# Altium project Conv-Comp.PrjPCB
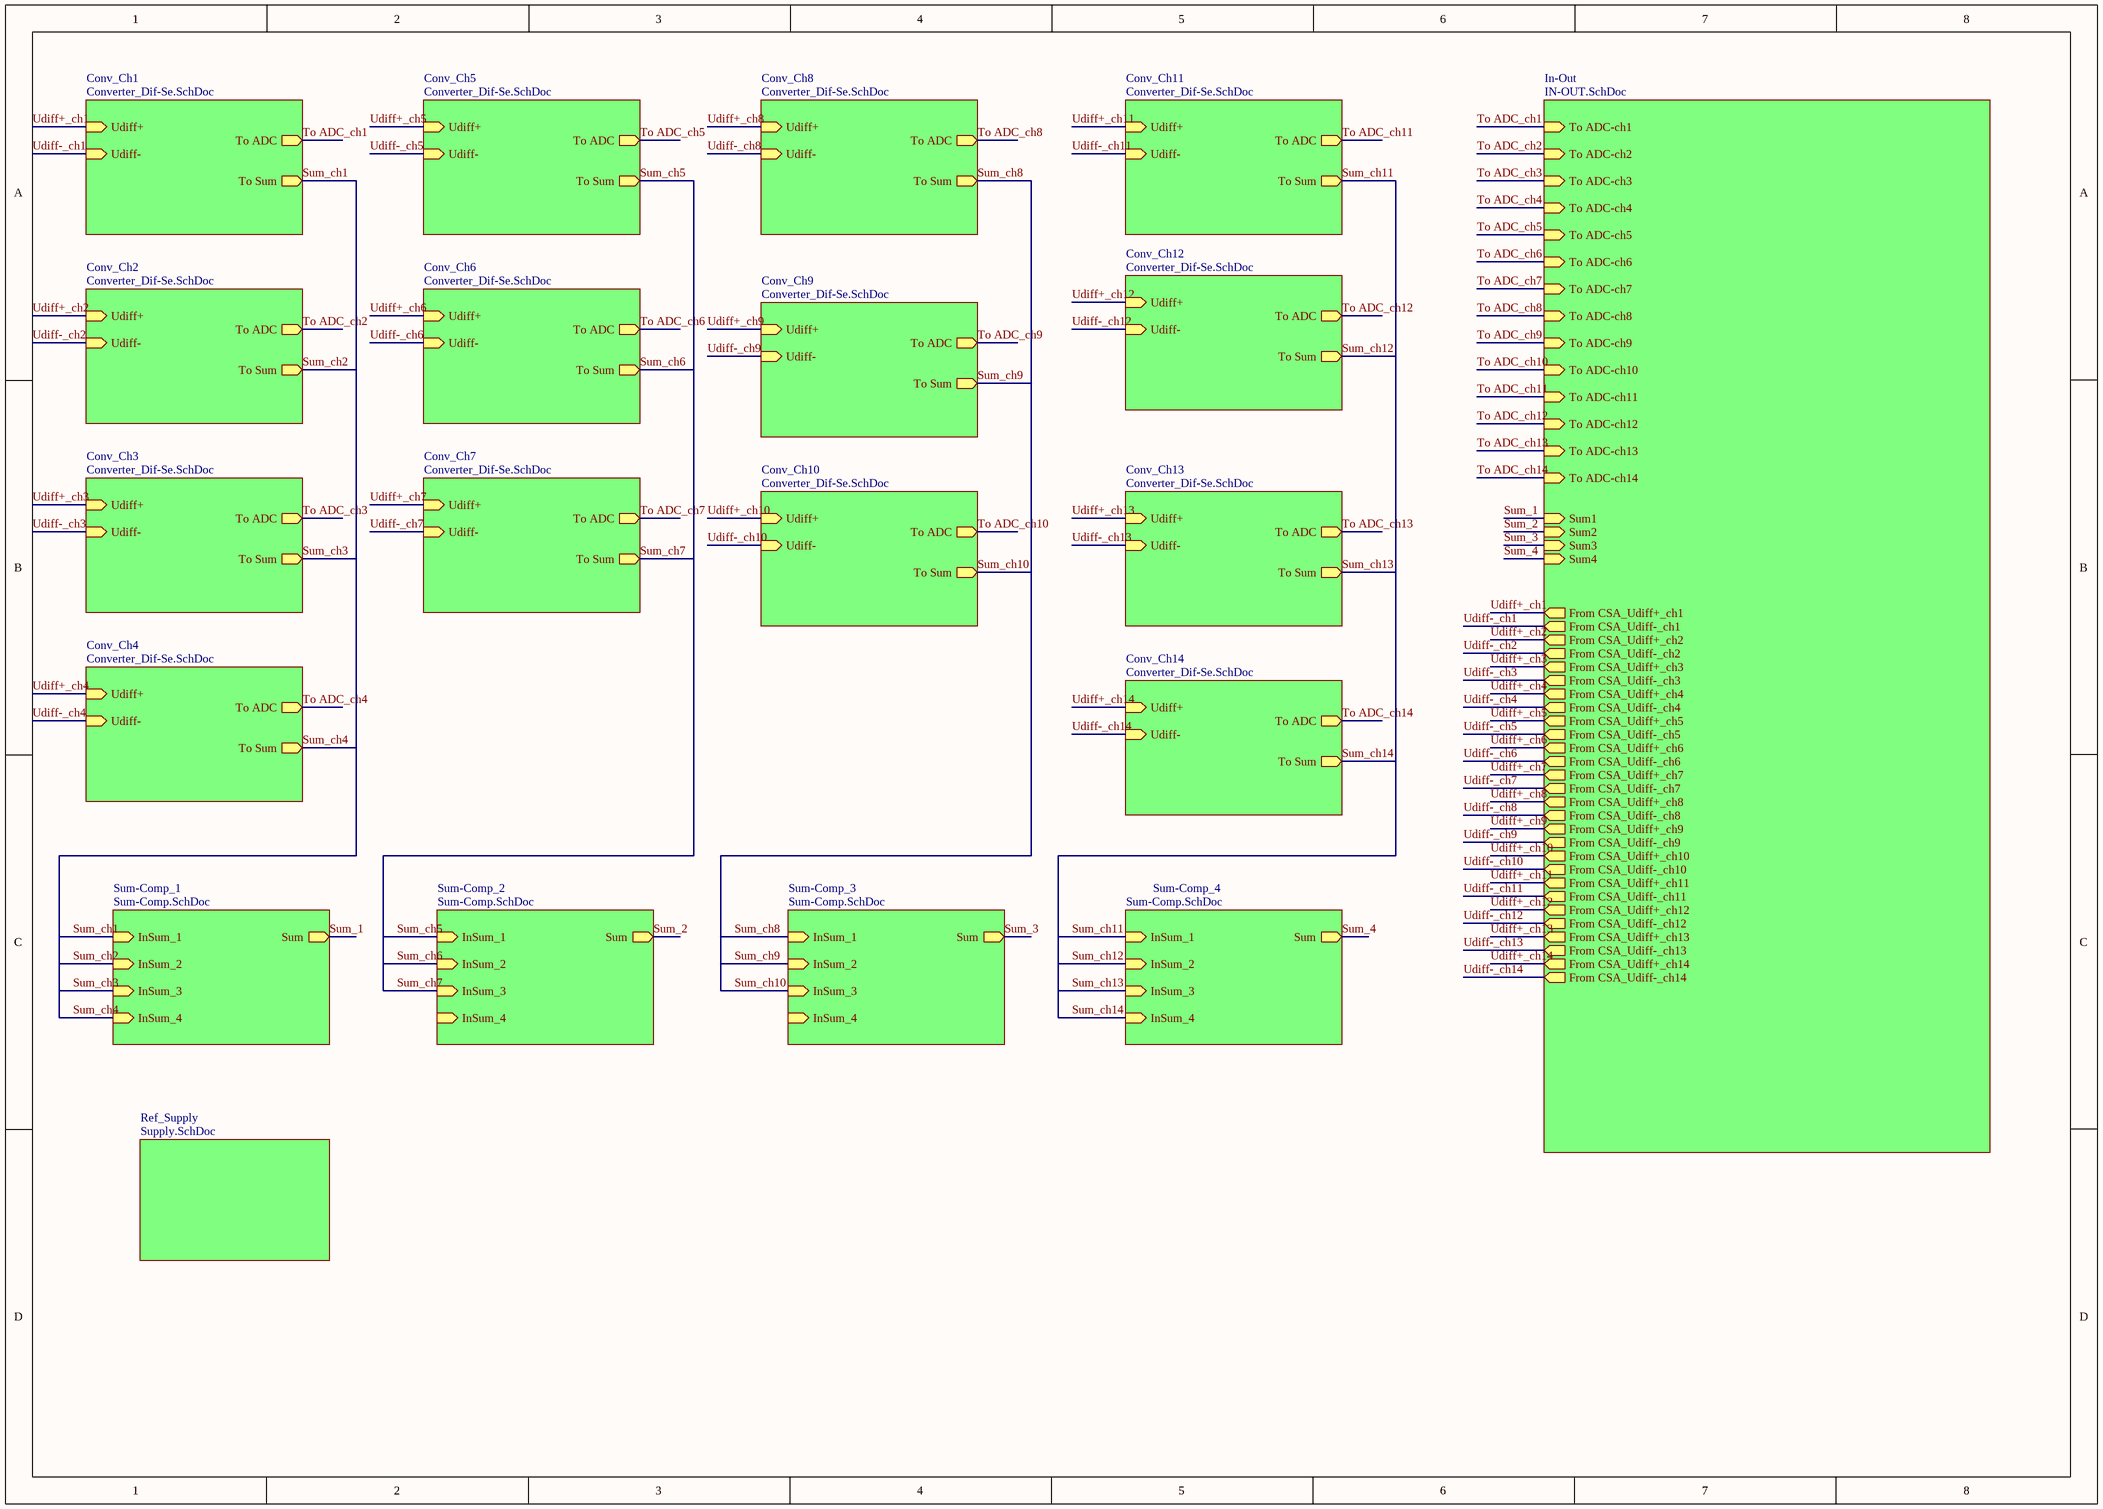
[diagram p0: Main.schdoc]
5 sheets, 255 parts. Net scope: hierarchical (ports join the sheet entries above them; power ports are global).
Board file: Conv-Comp_v.2.PCBDOC
Sheets:
  Main.schdoc
    Conv_Ch1 = Converter_Dif-Se.SchDoc
    Sum-Comp_1 = Sum-Comp.SchDoc
    Sum-Comp_2 = Sum-Comp.SchDoc
    Sum-Comp_3 = Sum-Comp.SchDoc
    Sum-Comp_4 = Sum-Comp.SchDoc
    Ref_Supply = Supply.SchDoc
    Conv_Ch2 = Converter_Dif-Se.SchDoc
    Conv_Ch3 = Converter_Dif-Se.SchDoc
    Conv_Ch4 = Converter_Dif-Se.SchDoc
    Conv_Ch5 = Converter_Dif-Se.SchDoc
    Conv_Ch6 = Converter_Dif-Se.SchDoc
    Conv_Ch7 = Converter_Dif-Se.SchDoc
    Conv_Ch8 = Converter_Dif-Se.SchDoc
    Conv_Ch9 = Converter_Dif-Se.SchDoc
    Conv_Ch10 = Converter_Dif-Se.SchDoc
    Conv_Ch11 = Converter_Dif-Se.SchDoc
    Conv_Ch12 = Converter_Dif-Se.SchDoc
    Conv_Ch13 = Converter_Dif-Se.SchDoc
    Conv_Ch14 = Converter_Dif-Se.SchDoc
    In-Out = IN-OUT.SchDoc

## Sheet Main.schdoc: Eurocard VME 6U with break-away tab (9.187 x 6.299 inches)
size A3; Organization: Organization; Address1: Address1; Address2: Address2; Address3: Address3; Address4: Address4; DocumentNumber: 1; Revision: 0; SheetNumber: 2; SheetTotal: 2

### Sub-sheets
Conv_Ch1 = Converter_Dif-Se.SchDoc: To ADC (out), To Sum (out), Udiff+ (in), Udiff- (in)
Conv_Ch2 = Converter_Dif-Se.SchDoc: To ADC (out), To Sum (out), Udiff+ (in), Udiff- (in)
Conv_Ch3 = Converter_Dif-Se.SchDoc: To ADC (out), To Sum (out), Udiff+ (in), Udiff- (in)
Conv_Ch4 = Converter_Dif-Se.SchDoc: To ADC (out), To Sum (out), Udiff+ (in), Udiff- (in)
Conv_Ch5 = Converter_Dif-Se.SchDoc: To ADC (out), To Sum (out), Udiff+ (in), Udiff- (in)
Conv_Ch6 = Converter_Dif-Se.SchDoc: To ADC (out), To Sum (out), Udiff+ (in), Udiff- (in)
Conv_Ch7 = Converter_Dif-Se.SchDoc: To ADC (out), To Sum (out), Udiff+ (in), Udiff- (in)
Conv_Ch8 = Converter_Dif-Se.SchDoc: To ADC (out), To Sum (out), Udiff+ (in), Udiff- (in)
Conv_Ch9 = Converter_Dif-Se.SchDoc: To ADC (out), To Sum (out), Udiff+ (in), Udiff- (in)
Conv_Ch10 = Converter_Dif-Se.SchDoc: To ADC (out), To Sum (out), Udiff+ (in), Udiff- (in)
Conv_Ch11 = Converter_Dif-Se.SchDoc: To ADC (out), To Sum (out), Udiff+ (in), Udiff- (in)
Conv_Ch12 = Converter_Dif-Se.SchDoc: To ADC (out), To Sum (out), Udiff+ (in), Udiff- (in)
Conv_Ch13 = Converter_Dif-Se.SchDoc: To ADC (out), To Sum (out), Udiff+ (in), Udiff- (in)
Conv_Ch14 = Converter_Dif-Se.SchDoc: To ADC (out), To Sum (out), Udiff+ (in), Udiff- (in)
In-Out = IN-OUT.SchDoc: To ADC-ch1 (in), To ADC-ch2 (in), To ADC-ch3 (in), To ADC-ch4 (in), To ADC-ch5 (in), To ADC-ch6 (in), To ADC-ch7 (in), To ADC-ch8 (in), To ADC-ch9 (in), To ADC-ch10 (in), To ADC-ch11 (in), To ADC-ch12 (in), To ADC-ch13 (in), To ADC-ch14 (in), From CSA_Udiff+_ch1 (out), From CSA_Udiff+_ch2 (out), From CSA_Udiff+_ch3 (out), From CSA_Udiff+_ch4 (out), From CSA_Udiff+_ch5 (out), From CSA_Udiff+_ch6 (out), From CSA_Udiff+_ch7 (out), From CSA_Udiff+_ch8 (out), From CSA_Udiff+_ch9 (out), From CSA_Udiff+_ch10 (out), From CSA_Udiff+_ch11 (out), From CSA_Udiff+_ch12 (out), From CSA_Udiff+_ch13 (out), From CSA_Udiff+_ch14 (out), From CSA_Udiff-_ch1 (out), From CSA_Udiff-_ch2 (out), From CSA_Udiff-_ch3 (out), From CSA_Udiff-_ch4 (out), From CSA_Udiff-_ch5 (out), From CSA_Udiff-_ch6 (out), From CSA_Udiff-_ch7 (out), From CSA_Udiff-_ch8 (out), From CSA_Udiff-_ch9 (out), From CSA_Udiff-_ch10 (out), From CSA_Udiff-_ch11 (out), From CSA_Udiff-_ch12 (out), From CSA_Udiff-_ch13 (out), From CSA_Udiff-_ch14 (out), Sum4 (in), Sum3 (in), Sum2 (in), Sum1 (in)
Ref_Supply = Supply.SchDoc: no entries
Sum-Comp_1 = Sum-Comp.SchDoc: InSum_1 (in), InSum_2 (in), InSum_3 (in), InSum_4 (in), Sum (out)
Sum-Comp_2 = Sum-Comp.SchDoc: InSum_1 (in), InSum_2 (in), InSum_3 (in), InSum_4 (in), Sum (out)
Sum-Comp_3 = Sum-Comp.SchDoc: InSum_1 (in), InSum_2 (in), InSum_3 (in), InSum_4 (in), Sum (out)
Sum-Comp_4 = Sum-Comp.SchDoc: InSum_1 (in), InSum_2 (in), InSum_3 (in), InSum_4 (in), Sum (out)

### Nets
Sum_1: sheet Sum-Comp_1/Sum, sheet In-Out/Sum1
Sum_2: sheet Sum-Comp_2/Sum, sheet In-Out/Sum2
Sum_3: sheet Sum-Comp_3/Sum, sheet In-Out/Sum3
Sum_4: sheet Sum-Comp_4/Sum, sheet In-Out/Sum4
Sum_ch1: sheet Conv_Ch1/To Sum, sheet Sum-Comp_1/InSum_1, sheet Sum-Comp_1/InSum_2, sheet Sum-Comp_1/InSum_3, sheet Sum-Comp_1/InSum_4, sheet Conv_Ch2/To Sum, sheet Conv_Ch3/To Sum, sheet Conv_Ch4/To Sum  [also labelled Sum_ch2, Sum_ch3, Sum_ch4]
Sum_ch5: sheet Sum-Comp_2/InSum_1, sheet Sum-Comp_2/InSum_2, sheet Sum-Comp_2/InSum_3, sheet Sum-Comp_2/InSum_4, sheet Conv_Ch5/To Sum, sheet Conv_Ch6/To Sum, sheet Conv_Ch7/To Sum  [also labelled Sum_ch6, Sum_ch7]
Sum_ch10: sheet Sum-Comp_3/InSum_1, sheet Sum-Comp_3/InSum_2, sheet Sum-Comp_3/InSum_3, sheet Sum-Comp_3/InSum_4, sheet Conv_Ch8/To Sum, sheet Conv_Ch9/To Sum, sheet Conv_Ch10/To Sum  [also labelled Sum_ch8, Sum_ch9]
Sum_ch11: sheet Sum-Comp_4/InSum_1, sheet Sum-Comp_4/InSum_2, sheet Sum-Comp_4/InSum_3, sheet Sum-Comp_4/InSum_4, sheet Conv_Ch11/To Sum, sheet Conv_Ch12/To Sum, sheet Conv_Ch13/To Sum, sheet Conv_Ch14/To Sum  [also labelled Sum_ch12, Sum_ch13, Sum_ch14]
To ADC_ch1: sheet Conv_Ch1/To ADC, sheet In-Out/To ADC-ch1
To ADC_ch2: sheet Conv_Ch2/To ADC, sheet In-Out/To ADC-ch2
To ADC_ch3: sheet Conv_Ch3/To ADC, sheet In-Out/To ADC-ch3
To ADC_ch4: sheet Conv_Ch4/To ADC, sheet In-Out/To ADC-ch4
To ADC_ch5: sheet Conv_Ch5/To ADC, sheet In-Out/To ADC-ch5
To ADC_ch6: sheet Conv_Ch6/To ADC, sheet In-Out/To ADC-ch6
To ADC_ch7: sheet Conv_Ch7/To ADC, sheet In-Out/To ADC-ch7
To ADC_ch8: sheet Conv_Ch8/To ADC, sheet In-Out/To ADC-ch8
To ADC_ch9: sheet Conv_Ch9/To ADC, sheet In-Out/To ADC-ch9
To ADC_ch10: sheet Conv_Ch10/To ADC, sheet In-Out/To ADC-ch10
To ADC_ch11: sheet Conv_Ch11/To ADC, sheet In-Out/To ADC-ch11
To ADC_ch12: sheet Conv_Ch12/To ADC, sheet In-Out/To ADC-ch12
To ADC_ch13: sheet Conv_Ch13/To ADC, sheet In-Out/To ADC-ch13
To ADC_ch14: sheet Conv_Ch14/To ADC, sheet In-Out/To ADC-ch14
Udiff+_ch1: sheet Conv_Ch1/Udiff+, sheet In-Out/From CSA_Udiff+_ch1
Udiff+_ch2: sheet Conv_Ch2/Udiff+, sheet In-Out/From CSA_Udiff+_ch2
Udiff+_ch3: sheet Conv_Ch3/Udiff+, sheet In-Out/From CSA_Udiff+_ch3
Udiff+_ch4: sheet Conv_Ch4/Udiff+, sheet In-Out/From CSA_Udiff+_ch4
Udiff+_ch5: sheet Conv_Ch5/Udiff+, sheet In-Out/From CSA_Udiff+_ch5
Udiff+_ch6: sheet Conv_Ch6/Udiff+, sheet In-Out/From CSA_Udiff+_ch6
Udiff+_ch7: sheet Conv_Ch7/Udiff+, sheet In-Out/From CSA_Udiff+_ch7
Udiff+_ch8: sheet Conv_Ch8/Udiff+, sheet In-Out/From CSA_Udiff+_ch8
Udiff+_ch9: sheet Conv_Ch9/Udiff+, sheet In-Out/From CSA_Udiff+_ch9
Udiff+_ch10: sheet Conv_Ch10/Udiff+, sheet In-Out/From CSA_Udiff+_ch10
Udiff+_ch11: sheet Conv_Ch11/Udiff+, sheet In-Out/From CSA_Udiff+_ch11
Udiff+_ch12: sheet Conv_Ch12/Udiff+, sheet In-Out/From CSA_Udiff+_ch12
Udiff+_ch13: sheet Conv_Ch13/Udiff+, sheet In-Out/From CSA_Udiff+_ch13
Udiff+_ch14: sheet Conv_Ch14/Udiff+, sheet In-Out/From CSA_Udiff+_ch14
Udiff-_ch1: sheet Conv_Ch1/Udiff-, sheet In-Out/From CSA_Udiff-_ch1
Udiff-_ch2: sheet Conv_Ch2/Udiff-, sheet In-Out/From CSA_Udiff-_ch2
Udiff-_ch3: sheet Conv_Ch3/Udiff-, sheet In-Out/From CSA_Udiff-_ch3
Udiff-_ch4: sheet Conv_Ch4/Udiff-, sheet In-Out/From CSA_Udiff-_ch4
Udiff-_ch5: sheet Conv_Ch5/Udiff-, sheet In-Out/From CSA_Udiff-_ch5
Udiff-_ch6: sheet Conv_Ch6/Udiff-, sheet In-Out/From CSA_Udiff-_ch6
Udiff-_ch7: sheet Conv_Ch7/Udiff-, sheet In-Out/From CSA_Udiff-_ch7
Udiff-_ch8: sheet Conv_Ch8/Udiff-, sheet In-Out/From CSA_Udiff-_ch8
Udiff-_ch9: sheet Conv_Ch9/Udiff-, sheet In-Out/From CSA_Udiff-_ch9
Udiff-_ch10: sheet Conv_Ch10/Udiff-, sheet In-Out/From CSA_Udiff-_ch10
Udiff-_ch11: sheet Conv_Ch11/Udiff-, sheet In-Out/From CSA_Udiff-_ch11
Udiff-_ch12: sheet Conv_Ch12/Udiff-, sheet In-Out/From CSA_Udiff-_ch12
Udiff-_ch13: sheet Conv_Ch13/Udiff-, sheet In-Out/From CSA_Udiff-_ch13
Udiff-_ch14: sheet Conv_Ch14/Udiff-, sheet In-Out/From CSA_Udiff-_ch14

## Sheet Converter_Dif-Se.SchDoc
size A
Used 14 times, as channels Conv_Ch1, Conv_Ch2, Conv_Ch3, Conv_Ch4, Conv_Ch5, Conv_Ch6, Conv_Ch7, Conv_Ch8, Conv_Ch9, Conv_Ch10, Conv_Ch11, Conv_Ch12, Conv_Ch13, Conv_Ch14. Parts and nets are listed once, with the designators drawn on the sheet.
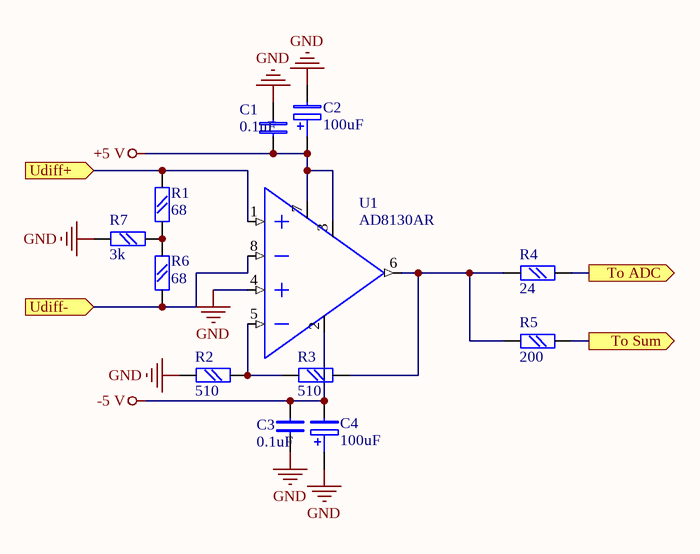
[diagram p1: Converter_Dif-Se.SchDoc]

### Parts
C1  0.1uF  [chip0805]
C2  100uF  [CEL-SMD300]
C3  0.1uF  [chip0805]
C4  100uF  [CEL-SMD300]
R1  68  [chip0805]
R2  510  [chip0805]
R3  510  [chip0805]
R4  24  [chip0805]
R5  200  [chip0805]
R6  68  [chip0805]
R7  3k  [chip0805]
U1  AD8130AR  [SO-8]

### Ports
To ADC (out), To Sum (out), Udiff+ (in), Udiff- (in)

### Nets
+5 V: C1.2 C2.+ U1.3(PD) U1.7(E+)
-5 V: C3.1 C4.- U1.2(E-)
GND: C1.1 C2.- C3.2 C4.+ R2.1 R7.2 U1.4(IN+)
To ADC: R4.2 ; port To ADC
To Sum: R5.2 ; port To Sum
Udiff+: R1.1 U1.1(+IN) ; port Udiff+
Udiff-: R6.2 U1.8(-IN) ; port Udiff-
NetR1_2: R1.2 R6.1 R7.1
NetR2_2: R2.2 R3.1 U1.5(IN-)
NetR3_2: R3.2 R4.1 R5.1 U1.6(OUT)

### Channels
Conv_Ch1: designators end in _Conv_Ch1; ports To ADC=To ADC_ch1 To Sum=Sum_ch1 Udiff+=Udiff+_ch1 Udiff-=Udiff-_ch1
Conv_Ch2: designators end in _Conv_Ch2; ports To ADC=To ADC_ch2 To Sum=Sum_ch1 Udiff+=Udiff+_ch2 Udiff-=Udiff-_ch2
Conv_Ch3: designators end in _Conv_Ch3; ports To ADC=To ADC_ch3 To Sum=Sum_ch1 Udiff+=Udiff+_ch3 Udiff-=Udiff-_ch3
Conv_Ch4: designators end in _Conv_Ch4; ports To ADC=To ADC_ch4 To Sum=Sum_ch1 Udiff+=Udiff+_ch4 Udiff-=Udiff-_ch4
Conv_Ch5: designators end in _Conv_Ch5; ports To ADC=To ADC_ch5 To Sum=Sum_ch5 Udiff+=Udiff+_ch5 Udiff-=Udiff-_ch5
Conv_Ch6: designators end in _Conv_Ch6; ports To ADC=To ADC_ch6 To Sum=Sum_ch5 Udiff+=Udiff+_ch6 Udiff-=Udiff-_ch6
Conv_Ch7: designators end in _Conv_Ch7; ports To ADC=To ADC_ch7 To Sum=Sum_ch5 Udiff+=Udiff+_ch7 Udiff-=Udiff-_ch7
Conv_Ch8: designators end in _Conv_Ch8; ports To ADC=To ADC_ch8 To Sum=Sum_ch10 Udiff+=Udiff+_ch8 Udiff-=Udiff-_ch8
Conv_Ch9: designators end in _Conv_Ch9; ports To ADC=To ADC_ch9 To Sum=Sum_ch10 Udiff+=Udiff+_ch9 Udiff-=Udiff-_ch9
Conv_Ch10: designators end in _Conv_Ch10; ports To ADC=To ADC_ch10 To Sum=Sum_ch10 Udiff+=Udiff+_ch10 Udiff-=Udiff-_ch10
Conv_Ch11: designators end in _Conv_Ch11; ports To ADC=To ADC_ch11 To Sum=Sum_ch11 Udiff+=Udiff+_ch11 Udiff-=Udiff-_ch11
Conv_Ch12: designators end in _Conv_Ch12; ports To ADC=To ADC_ch12 To Sum=Sum_ch11 Udiff+=Udiff+_ch12 Udiff-=Udiff-_ch12
Conv_Ch13: designators end in _Conv_Ch13; ports To ADC=To ADC_ch13 To Sum=Sum_ch11 Udiff+=Udiff+_ch13 Udiff-=Udiff-_ch13
Conv_Ch14: designators end in _Conv_Ch14; ports To ADC=To ADC_ch14 To Sum=Sum_ch11 Udiff+=Udiff+_ch14 Udiff-=Udiff-_ch14

### Library data of the parts
C1 C3 = C: Text Field1: 20; Text Field2: 10
C2 C4 = C POL: Text Field1: 20; Text Field2: 20
R1-R7 = R: Text Field1: 20; Text Field2: 20
U1 = AD8130

## Sheet Sum-Comp.SchDoc
size A
Used 4 times, as channels Sum-Comp_1, Sum-Comp_2, Sum-Comp_3, Sum-Comp_4. Parts and nets are listed once, with the designators drawn on the sheet.
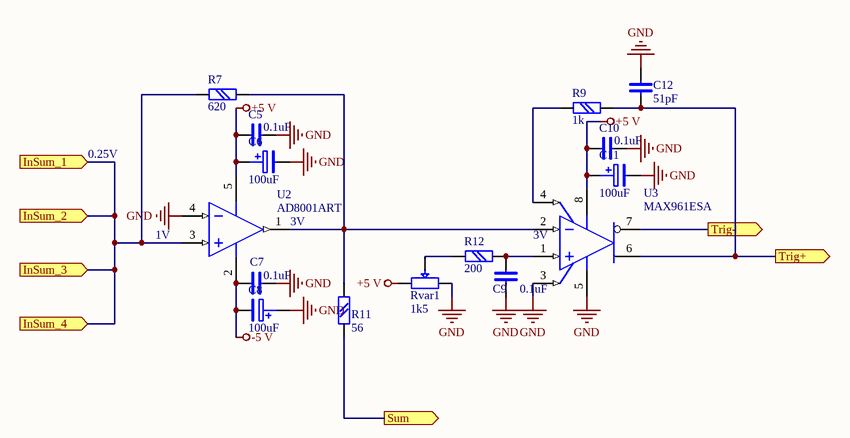
[diagram p2: Sum-Comp.SchDoc]

### Parts
C5  0.1uF  [chip0805]
C6  100uF  [CEL-SMD300]
C7  0.1uF  [chip0805]
C8  100uF  [CEL-SMD300]
C9  0.1uF  [chip0805]
C10  0.1uF  [chip0805]
C11  100uF  [CEL-SMD300]
C12  51pF  [chip0805]
R7  620  [chip0805]
R9  1k  [chip0805]
R11  56  [chip0805]
R12  200  [chip0805]
Rvar1  1k5  [RVAR1]
U2  AD8001ART  [RT-5]
U3  MAX961ESA  [NSO8_N]

### Ports
InSum_1 (in), InSum_2 (in), InSum_3 (in), InSum_4 (in), Sum (out), Trig+ (out), Trig- (out)

### Nets
+5 V: C5.2 C6.+ C10.2 C11.+ Rvar1.1 U2.5(V+) U3.8(V+)
-5 V: C7.2 C8.- U2.2(V-)
GND: C5.1 C6.- C7.1 C8.+ C9.1 C10.1 C11.- C12.1 Rvar1.3 U2.4(IN-) U3.3(SHDN) U3.5(GND)
InSum_1: R7.1 U2.3(IN+) ; port InSum_1, port InSum_2, port InSum_3, port InSum_4
Sum: R11.1 ; port Sum
Trig+: C12.2 R9.2 U3.6(Q) ; port Trig+
Trig-: U3.7(~{Q}) ; port Trig-
NetC9_2: C9.2 R12.2 U3.1(IN+)
NetR7_2: R7.2 R11.2 U2.1(OUT) U3.2(IN-)
NetR9_1: R9.1 U3.4(LE)
NetR12_1: R12.1 Rvar1.2

### Channels
Sum-Comp_1: designators end in _Sum-Comp_1; ports InSum_1=Sum_ch1 InSum_2=Sum_ch1 InSum_3=Sum_ch1 InSum_4=Sum_ch1 Sum=Sum_1 Trig+=NetC12_Sum-Comp_1_2 Trig-=NetU3_Sum-Comp_1_7
Sum-Comp_2: designators end in _Sum-Comp_2; ports InSum_1=Sum_ch5 InSum_2=Sum_ch5 InSum_3=Sum_ch5 InSum_4=Sum_ch5 Sum=Sum_2 Trig+=NetC12_Sum-Comp_2_2 Trig-=NetU3_Sum-Comp_2_7
Sum-Comp_3: designators end in _Sum-Comp_3; ports InSum_1=Sum_ch10 InSum_2=Sum_ch10 InSum_3=Sum_ch10 InSum_4=Sum_ch10 Sum=Sum_3 Trig+=NetC12_Sum-Comp_3_2 Trig-=NetU3_Sum-Comp_3_7
Sum-Comp_4: designators end in _Sum-Comp_4; ports InSum_1=Sum_ch11 InSum_2=Sum_ch11 InSum_3=Sum_ch11 InSum_4=Sum_ch11 Sum=Sum_4 Trig+=NetC12_Sum-Comp_4_2 Trig-=NetU3_Sum-Comp_4_7

### Notes on the sheet
- 0.25V
- (near U2) 1V
- (near U2) 3V
- (near U3) 3V

### Library data of the parts
C5 C7 C9 C10 C12 = C: Text Field1: 20; Text Field2: 10
C6 C8 C11 = C POL: Text Field1: 20; Text Field2: 20
R7 R9 R11 R12 = R: Text Field1: 20; Text Field2: 20
Rvar1 = R VAR: Text Field1: 20; Text Field2: 20
U2 = AD8055ART: Low Cost, 300MHz Voltage Feedback Amplifier; Published: 8-Jun-2000; LatestRevisionDate: 17-Jul-2002; LatestRevisionNote: Re-released for DXP Platform.; DatasheetVersion: REV. 0 1997; PackageReference: RT-5; Publisher: Altium Limited; PackageDescription: SOT-23/SC-74A; 5 Leads; Body 3.1 x 3 mm, inc. leads (LxW max); Code_JEDEC: MO-178AA; ComponentLink1Description: Manufacturer Link; ComponentLink1URL: http://www.analog.com/en/prod/0,,759_786_AD8055%2C00.html; ComponentLink2Description: Datasheet; ComponentLink2URL: http://www.analog.com/UploadedFiles/Data_Sheets/40402558757264AD8055_6_i.pdf
U3 = MAX961ESA: Single Ultra-High-Speed, +3V/+5V, Beyond-the-Rails Comparator; Published: 16-Jan-2001; LatestRevisionDate: 13-Apr-2006; LatestRevisionNote: IPC-7351 Footprint Added.; DatasheetVersion: Jan-1998; PackageReference: NSO8; Publisher: Altium Limited; PackageDescription: 8-Pin Small Outline Integrated Circuit 1.27 mm Pitch; Code_JEDEC: MS-012-AA; Code_IPC: SOIC127P600-8; ComponentLink1Description: Manufacturer Link; ComponentLink1URL: http://www.maxim-ic.com/; ComponentLink2Description: Datasheet; ComponentLink2URL: http://pdfserv.maxim-ic.com/en/ds/MAX961-MAX999.pdf

## Sheet Supply.SchDoc
size A4
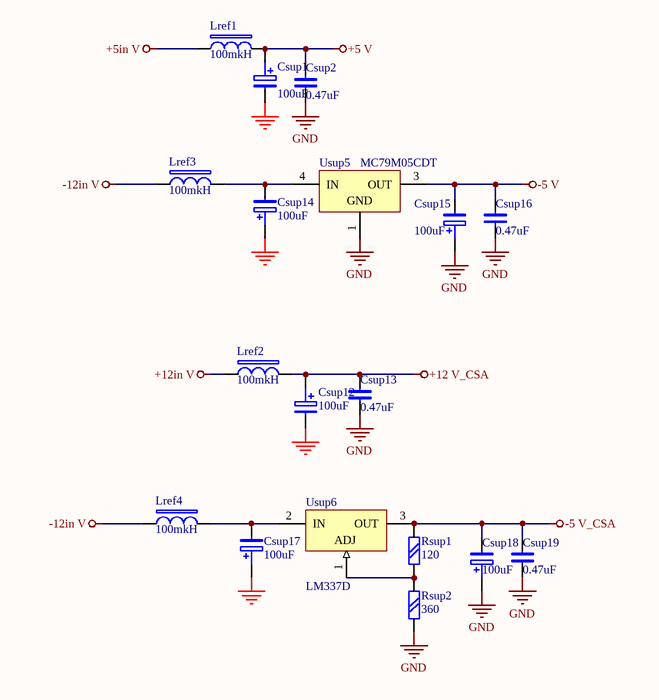
[diagram p3: Supply.SchDoc]

### Parts
Csup1  100uF  [CEL-SMD300]
Csup2  0.47uF  [chip0805]
Csup12  100uF  [CEL-SMD300]
Csup13  0.47uF  [chip0805]
Csup14  100uF  [CEL-SMD300]
Csup15  100uF  [CEL-SMD300]
Csup16  0.47uF  [chip0805]
Csup17  100uF  [CEL-SMD300]
Csup18  100uF  [CEL-SMD300]
Csup19  0.47uF  [chip0805]
Lref1  100mkH  [SDR0604]
Lref2  100mkH  [SDR0604]
Lref3  100mkH  [SDR0604]
Lref4  100mkH  [SDR0604]
Rsup1  120  [chip0805]
Rsup2  360  [chip0805]
Usup5  MC79M05CDT  [369A-13]
Usup6  LM337D  [TO-220B]

### Nets
+5 V: Csup1.+ Csup2.1 Lref1.2
+5in V: Lref1.1
+12 V_CSA: Csup12.+ Csup13.1 Lref2.2
+12in V: Lref2.1
-5 V: Csup15.- Csup16.1 Usup5.3(OUT)
-5 V_CSA: Csup18.- Csup19.1 Rsup1.1 Usup6.3(OUT)
-12in V: Lref3.1 Lref4.1
GND: Csup1.- Csup2.2 Csup12.- Csup13.2 Csup14.+ Csup15.+ Csup16.2 Csup17.+ Csup18.+ Csup19.2 Rsup2.2 Usup5.1(GND)
NetCsup14_-: Csup14.- Lref3.2 Usup5.4(IN)
NetCsup17_-: Csup17.- Lref4.2 Usup6.2(IN)
NetRsup1_2: Rsup1.2 Rsup2.1 Usup6.1(ADJ)

### Library data of the parts
Csup1 Csup12 Csup14 Csup15 Csup17 Csup18 = C POL: Text Field1: 20; Text Field2: 20
Csup2 Csup13 Csup16 Csup19 = C: Text Field1: 20; Text Field2: 10
Lref1-Lref4 = DR: Text Field1: 30; Text Field2: 10
Rsup1 Rsup2 = R: Text Field1: 20; Text Field2: 20
Usup5 = MC79M05CDT: Three-Terminal Negative Voltage Regulator; Note: Pin 4 is TAB; Pin 2 is trimmed; Published: 15-Apr-2002; DatasheetVersion: 1996; PackageVersion: 1997; PackageReference: 369A-13; Publisher: Altium Limited; PackageDescription: D-PAK/TO-252-AA; 3 Leads (1 Cropped); Body 10.3 (inc. leads) x 6.7 mm (LxW max); ComponentLink1Description: Manufacturer Link; ComponentLink1URL: http://www.onsemi.com/site/products/taxonomy/0,4438,503,00.html; ComponentLink2Description: Datasheet; ComponentLink2URL: http://www.onsemi.com/pub/Collateral/MC79M00-D.PDF
Usup6 = LM337T: Three-Terminal Adjustable Output Negative Voltage; Note: Heatsink surface is connected to Pin 2; Published: 15-Apr-2002; DatasheetVersion: 1996; PackageVersion: 1997; PackageReference: 221A-06; Publisher: Altium Limited; PackageDescription: TO, Thru-Hole, Vertical, Heatsink Mounted; 3 In-Line Leads; Pitch 2.54 mm; Code_JEDEC: TO-262-AA; ComponentLink1Description: Manufacturer Link; ComponentLink1URL: http://www.onsemi.com/site/products/taxonomy/0,4438,503,00.html; ComponentLink2Description: Datasheet; ComponentLink2URL: http://www.onsemi.com/pub/Collateral/LM337-D.PDF

## Sheet IN-OUT.SchDoc
size A4
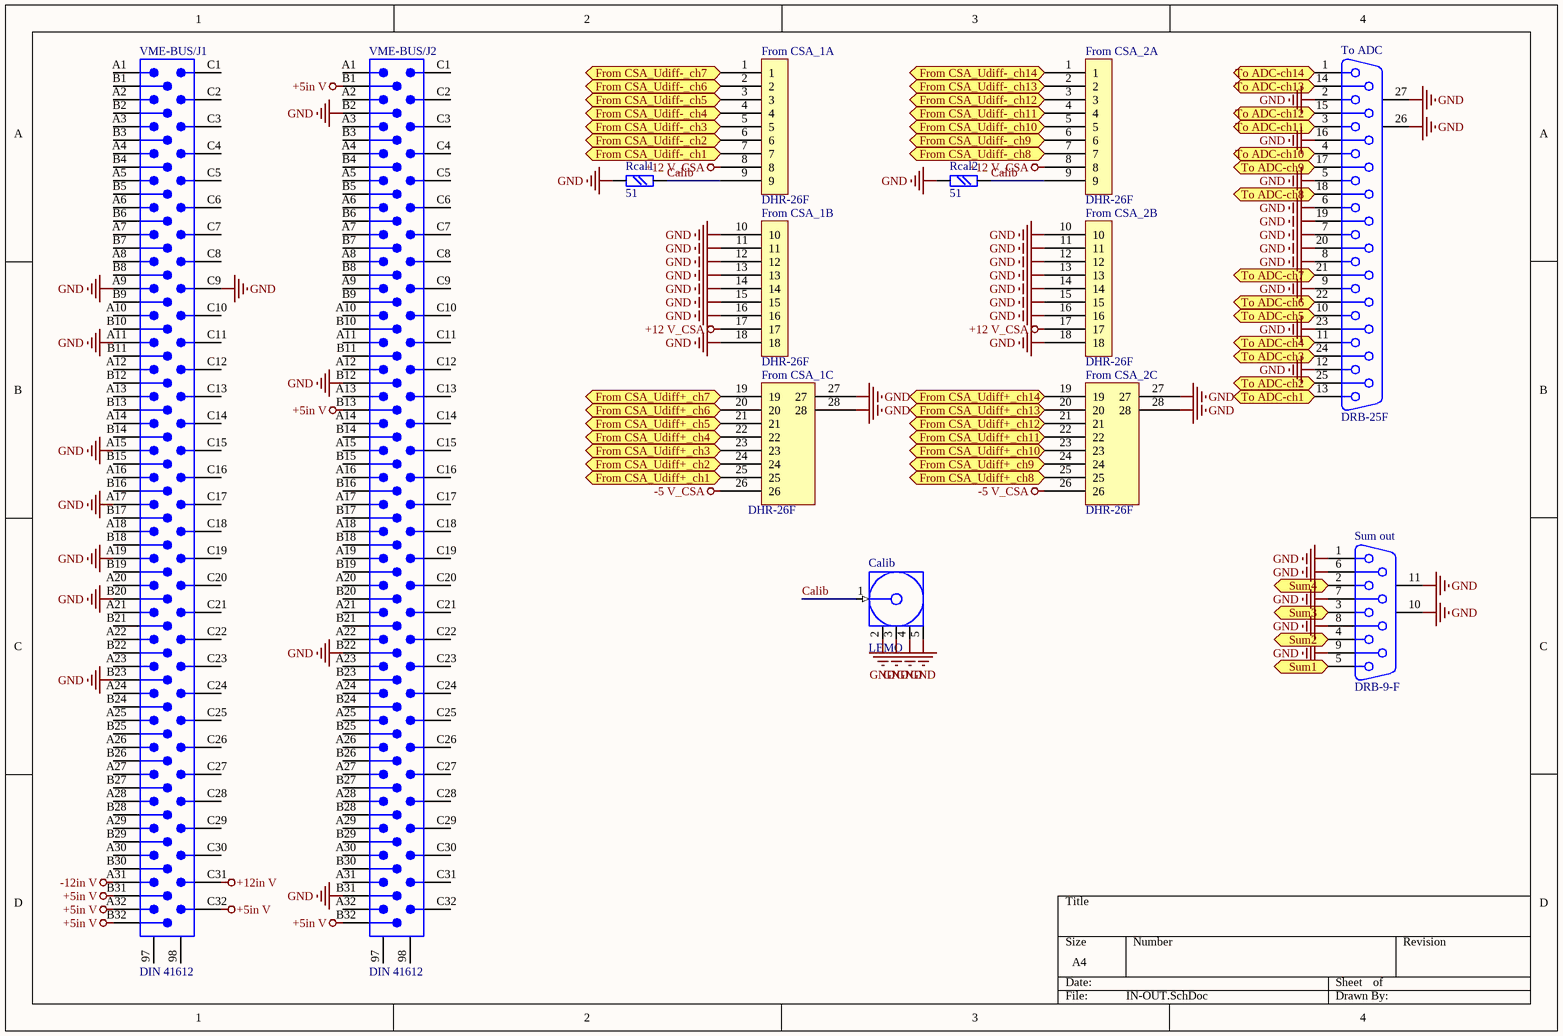
[diagram p4: IN-OUT.SchDoc]

### Parts
Calib  LEMO  [LEMO]
From_CSA_1  DHR-26F  [DHR-F-26]  (parts A,B,C of 3)
From_CSA_2  DHR-26F  [DHR-F-26]  (parts A,B,C of 3)
Rcal1  51  [chip0805]
Rcal2  51  [chip0805]
Sum_out  DRB-9-F  [DSUB1.385-2H9]
To_ADC  DRB-25F  [DSUB1.385-2H25A]
VME-BUS/J1  DIN 41612  [EURO2.54-2H96]
VME-BUS/J2  DIN 41612  [EURO2.54-2H96]

### Ports
From CSA_Udiff+_ch1 (in), From CSA_Udiff+_ch2 (in), From CSA_Udiff+_ch3 (in), From CSA_Udiff+_ch4 (in), From CSA_Udiff+_ch5 (in), From CSA_Udiff+_ch6 (in), From CSA_Udiff+_ch7 (in), From CSA_Udiff+_ch8 (in), From CSA_Udiff+_ch9 (in), From CSA_Udiff+_ch10 (in), From CSA_Udiff+_ch11 (in), From CSA_Udiff+_ch12 (in), From CSA_Udiff+_ch13 (in), From CSA_Udiff+_ch14 (in), From CSA_Udiff-_ch1 (in), From CSA_Udiff-_ch2 (in), From CSA_Udiff-_ch3 (in), From CSA_Udiff-_ch4 (in), From CSA_Udiff-_ch5 (in), From CSA_Udiff-_ch6 (in), From CSA_Udiff-_ch7 (in), From CSA_Udiff-_ch8 (in), From CSA_Udiff-_ch9 (in), From CSA_Udiff-_ch10 (in), From CSA_Udiff-_ch11 (in), From CSA_Udiff-_ch12 (in), From CSA_Udiff-_ch13 (in), From CSA_Udiff-_ch14 (in), Sum1 (in), Sum2 (in), Sum3 (in), Sum4 (in), To ADC-ch1 (in), To ADC-ch2 (in), To ADC-ch3 (in), To ADC-ch4 (in), To ADC-ch5 (in), To ADC-ch6 (in), To ADC-ch7 (in), To ADC-ch8 (in), To ADC-ch9 (in), To ADC-ch10 (in), To ADC-ch11 (in), To ADC-ch12 (in), To ADC-ch13 (in), To ADC-ch14 (in)

### Nets
+5in V: VME-BUS/J1.A32 VME-BUS/J1.B31 VME-BUS/J1.B32 VME-BUS/J1.C32 VME-BUS/J2.B1 VME-BUS/J2.B13 VME-BUS/J2.B32
+12 V_CSA: From_CSA_1.8 From_CSA_1.17 From_CSA_2.8 From_CSA_2.17
+12in V: VME-BUS/J1.C31
-5 V_CSA: From_CSA_1.26 From_CSA_2.26
-12in V: VME-BUS/J1.A31
GND: Calib.2(GND) Calib.3(GND) Calib.4(GND) Calib.5(GND) From_CSA_1.10 From_CSA_1.11 From_CSA_1.12 From_CSA_1.13 From_CSA_1.14 From_CSA_1.15 From_CSA_1.16 From_CSA_1.18 From_CSA_1.27 From_CSA_1.28 From_CSA_2.10 From_CSA_2.11 From_CSA_2.12 From_CSA_2.13 From_CSA_2.14 From_CSA_2.15 From_CSA_2.16 From_CSA_2.18 From_CSA_2.27 From_CSA_2.28 Rcal1.2 Rcal2.2 Sum_out.1 Sum_out.6 Sum_out.7 Sum_out.8 Sum_out.9 Sum_out.10(MH1) Sum_out.11(MH2) To_ADC.2 To_ADC.5 To_ADC.6 To_ADC.7 To_ADC.8 To_ADC.9 To_ADC.12 To_ADC.16 To_ADC.19 To_ADC.20 To_ADC.23 To_ADC.26(MH1) To_ADC.27(MH2) VME-BUS/J1.A9 VME-BUS/J1.A11 VME-BUS/J1.A15 VME-BUS/J1.A17 VME-BUS/J1.A19 VME-BUS/J1.B20 VME-BUS/J1.B23 VME-BUS/J1.C9 VME-BUS/J2.B2 VME-BUS/J2.B12 VME-BUS/J2.B22 VME-BUS/J2.B31
Calib: Calib.1(Signal) From_CSA_1.9 From_CSA_2.9 Rcal1.1 Rcal2.1
Sum_1: Sum_out.5 ; port Sum1
Sum_2: Sum_out.4 ; port Sum2
Sum_3: Sum_out.3 ; port Sum3
Sum_4: Sum_out.2 ; port Sum4
To ADC_ch1: To_ADC.13 ; port To ADC-ch1
To ADC_ch2: To_ADC.25 ; port To ADC-ch2
To ADC_ch3: To_ADC.24 ; port To ADC-ch3
To ADC_ch4: To_ADC.11 ; port To ADC-ch4
To ADC_ch5: To_ADC.10 ; port To ADC-ch5
To ADC_ch6: To_ADC.22 ; port To ADC-ch6
To ADC_ch7: To_ADC.21 ; port To ADC-ch7
To ADC_ch8: To_ADC.18 ; port To ADC-ch8
To ADC_ch9: To_ADC.17 ; port To ADC-ch9
To ADC_ch10: To_ADC.4 ; port To ADC-ch10
To ADC_ch11: To_ADC.3 ; port To ADC-ch11
To ADC_ch12: To_ADC.15 ; port To ADC-ch12
To ADC_ch13: To_ADC.14 ; port To ADC-ch13
To ADC_ch14: To_ADC.1 ; port To ADC-ch14
Udiff+_ch1: From_CSA_1.25 ; port From CSA_Udiff+_ch1
Udiff+_ch2: From_CSA_1.24 ; port From CSA_Udiff+_ch2
Udiff+_ch3: From_CSA_1.23 ; port From CSA_Udiff+_ch3
Udiff+_ch4: From_CSA_1.22 ; port From CSA_Udiff+_ch4
Udiff+_ch5: From_CSA_1.21 ; port From CSA_Udiff+_ch5
Udiff+_ch6: From_CSA_1.20 ; port From CSA_Udiff+_ch6
Udiff+_ch7: From_CSA_1.19 ; port From CSA_Udiff+_ch7
Udiff+_ch8: From_CSA_2.25 ; port From CSA_Udiff+_ch8
Udiff+_ch9: From_CSA_2.24 ; port From CSA_Udiff+_ch9
Udiff+_ch10: From_CSA_2.23 ; port From CSA_Udiff+_ch10
Udiff+_ch11: From_CSA_2.22 ; port From CSA_Udiff+_ch11
Udiff+_ch12: From_CSA_2.21 ; port From CSA_Udiff+_ch12
Udiff+_ch13: From_CSA_2.20 ; port From CSA_Udiff+_ch13
Udiff+_ch14: From_CSA_2.19 ; port From CSA_Udiff+_ch14
Udiff-_ch1: From_CSA_1.7 ; port From CSA_Udiff-_ch1
Udiff-_ch2: From_CSA_1.6 ; port From CSA_Udiff-_ch2
Udiff-_ch3: From_CSA_1.5 ; port From CSA_Udiff-_ch3
Udiff-_ch4: From_CSA_1.4 ; port From CSA_Udiff-_ch4
Udiff-_ch5: From_CSA_1.3 ; port From CSA_Udiff-_ch5
Udiff-_ch6: From_CSA_1.2 ; port From CSA_Udiff-_ch6
Udiff-_ch7: From_CSA_1.1 ; port From CSA_Udiff-_ch7
Udiff-_ch8: From_CSA_2.7 ; port From CSA_Udiff-_ch8
Udiff-_ch9: From_CSA_2.6 ; port From CSA_Udiff-_ch9
Udiff-_ch10: From_CSA_2.5 ; port From CSA_Udiff-_ch10
Udiff-_ch11: From_CSA_2.4 ; port From CSA_Udiff-_ch11
Udiff-_ch12: From_CSA_2.3 ; port From CSA_Udiff-_ch12
Udiff-_ch13: From_CSA_2.2 ; port From CSA_Udiff-_ch13
Udiff-_ch14: From_CSA_2.1 ; port From CSA_Udiff-_ch14

Not connected (* = marked no-connect by the designer): VME-BUS/J1 97 98 A1 A2 A3 A4 A5 A6 A7 A8 A10 A12 A13 A14 A16 A18 A20 A21 A22 A23 A24 A25 A26 A27 A28 A29 A30 B1 B2 B3 B4 B5 B6 B7 B8 B9 B10 B11 B12 B13 B14 B15 B16 B17 B18 B19 B21 B22 B24 B25 B26 B27 B28 B29 B30 C1 C2 C3 C4 C5 C6 C7 C8 C10 C11 C12 C13 C14 C15 C16 C17 C18 C19 C20 C21 C22 C23 C24 C25 C26 C27 C28 C29 C30; VME-BUS/J2 97 98 A1 A2 A3 A4 A5 A6 A7 A8 A9 A10 A11 A12 A13 A14 A15 A16 A17 A18 A19 A20 A21 A22 A23 A24 A25 A26 A27 A28 A29 A30 A31 A32 B3 B4 B5 B6 B7 B8 B9 B10 B11 B14 B15 B16 B17 B18 B19 B20 B21 B23 B24 B25 B26 B27 B28 B29 B30 C1 C2 C3 C4 C5 C6 C7 C8 C9 C10 C11 C12 C13 C14 C15 C16 C17 C18 C19 C20 C21 C22 C23 C24 C25 C26 C27 C28 C29 C30 C31 C32

### Library data of the parts
Calib = COAX-F: RF Coaxial PCB Connector, MCX; Thru-Hole, Right-Angle Mount Socket, Blunt Post Terminal, 50 Ohm Impedance; PCB_Layout: Complies with manufacturer's recommendation.; DrillSize: Corresponds to nominal value.; Published: 15-Jul-2004; LatestRevisionDate: 15-Jul-2004; LatestRevisionNote: Component Replaced.; DatasheetDocument: 30-May-2003; PackageDocument: 04-Jul-1999; PackageReference: 919-119J-51AX; Publisher: Altium Limited; ComponentLink1Description: Manufacturer Link; ComponentLink1URL: http://www.amphenolrf.com/
Rcal1 Rcal2 = R: Text Field1: 20; Text Field2: 20
Sum_out = D Connector 9: Receptacle Assembly, 9 Position, Right Angle; PackageDocument: O; Positions: 9; Published: 15-Jun-2001; LatestRevisionDate: 17-Jul-2002; LatestRevisionNote: Re-released for DXP Platform.; DatasheetDocument: 1-Sep-1999; PackageReference: 788750; Publisher: Altium Limited; Orientation: Right Angle; Gender: Receptacle
To_ADC = D Connector 25: Receptacle Assembly, 25 Position, Right Angle; PackageDocument: U; Positions: 25; Published: 15-Jun-2001; LatestRevisionDate: 17-Jul-2002; LatestRevisionNote: Re-released for DXP Platform.; DatasheetDocument: 19-Mar-1999; PackageReference: 787202; Publisher: Altium Limited; Orientation: Right Angle; Gender: Receptacle
VME-BUS/J1 VME-BUS/J2 = CNVME96: 96-Pin Connector (3x32 2.54mm grid); Text Field6: Alternate Layout Available; Text Field7: Published 14-Feb-2002

## Nets that join several sheets
+5 V: Conv_Ch1 (C1_Conv_Ch1.2 C2_Conv_Ch1.+ U1_Conv_Ch1.3 U1_Conv_Ch1.7), Sum-Comp_1 (7 pins), Sum-Comp_2 (7 pins), Sum-Comp_3 (7 pins), Sum-Comp_4 (7 pins), Supply (Csup1.+ Csup2.1 Lref1.2), Conv_Ch2 (C1_Conv_Ch2.2 C2_Conv_Ch2.+ U1_Conv_Ch2.3 U1_Conv_Ch2.7), Conv_Ch3 (C1_Conv_Ch3.2 C2_Conv_Ch3.+ U1_Conv_Ch3.3 U1_Conv_Ch3.7), Conv_Ch4 (C1_Conv_Ch4.2 C2_Conv_Ch4.+ U1_Conv_Ch4.3 U1_Conv_Ch4.7), Conv_Ch5 (C1_Conv_Ch5.2 C2_Conv_Ch5.+ U1_Conv_Ch5.3 U1_Conv_Ch5.7), Conv_Ch6 (C1_Conv_Ch6.2 C2_Conv_Ch6.+ U1_Conv_Ch6.3 U1_Conv_Ch6.7), Conv_Ch7 (C1_Conv_Ch7.2 C2_Conv_Ch7.+ U1_Conv_Ch7.3 U1_Conv_Ch7.7), Conv_Ch8 (C1_Conv_Ch8.2 C2_Conv_Ch8.+ U1_Conv_Ch8.3 U1_Conv_Ch8.7), Conv_Ch9 (C1_Conv_Ch9.2 C2_Conv_Ch9.+ U1_Conv_Ch9.3 U1_Conv_Ch9.7), Conv_Ch10 (C1_Conv_Ch10.2 C2_Conv_Ch10.+ U1_Conv_Ch10.3 U1_Conv_Ch10.7), Conv_Ch11 (C1_Conv_Ch11.2 C2_Conv_Ch11.+ U1_Conv_Ch11.3 U1_Conv_Ch11.7), Conv_Ch12 (C1_Conv_Ch12.2 C2_Conv_Ch12.+ U1_Conv_Ch12.3 U1_Conv_Ch12.7), Conv_Ch13 (C1_Conv_Ch13.2 C2_Conv_Ch13.+ U1_Conv_Ch13.3 U1_Conv_Ch13.7), Conv_Ch14 (C1_Conv_Ch14.2 C2_Conv_Ch14.+ U1_Conv_Ch14.3 U1_Conv_Ch14.7)
+5in V: Supply (Lref1.1), IN-OUT (7 pins)
+12 V_CSA: Supply (Csup12.+ Csup13.1 Lref2.2), IN-OUT (From_CSA_1.8 From_CSA_1.17 From_CSA_2.8 From_CSA_2.17)
+12in V: Supply (Lref2.1), IN-OUT (VME-BUS/J1.C31)
-5 V: Conv_Ch1 (C3_Conv_Ch1.1 C4_Conv_Ch1.- U1_Conv_Ch1.2), Sum-Comp_1 (C7_Sum-Comp_1.2 C8_Sum-Comp_1.- U2_Sum-Comp_1.2), Sum-Comp_2 (C7_Sum-Comp_2.2 C8_Sum-Comp_2.- U2_Sum-Comp_2.2), Sum-Comp_3 (C7_Sum-Comp_3.2 C8_Sum-Comp_3.- U2_Sum-Comp_3.2), Sum-Comp_4 (C7_Sum-Comp_4.2 C8_Sum-Comp_4.- U2_Sum-Comp_4.2), Supply (Csup15.- Csup16.1 Usup5.3), Conv_Ch2 (C3_Conv_Ch2.1 C4_Conv_Ch2.- U1_Conv_Ch2.2), Conv_Ch3 (C3_Conv_Ch3.1 C4_Conv_Ch3.- U1_Conv_Ch3.2), Conv_Ch4 (C3_Conv_Ch4.1 C4_Conv_Ch4.- U1_Conv_Ch4.2), Conv_Ch5 (C3_Conv_Ch5.1 C4_Conv_Ch5.- U1_Conv_Ch5.2), Conv_Ch6 (C3_Conv_Ch6.1 C4_Conv_Ch6.- U1_Conv_Ch6.2), Conv_Ch7 (C3_Conv_Ch7.1 C4_Conv_Ch7.- U1_Conv_Ch7.2), Conv_Ch8 (C3_Conv_Ch8.1 C4_Conv_Ch8.- U1_Conv_Ch8.2), Conv_Ch9 (C3_Conv_Ch9.1 C4_Conv_Ch9.- U1_Conv_Ch9.2), Conv_Ch10 (C3_Conv_Ch10.1 C4_Conv_Ch10.- U1_Conv_Ch10.2), Conv_Ch11 (C3_Conv_Ch11.1 C4_Conv_Ch11.- U1_Conv_Ch11.2), Conv_Ch12 (C3_Conv_Ch12.1 C4_Conv_Ch12.- U1_Conv_Ch12.2), Conv_Ch13 (C3_Conv_Ch13.1 C4_Conv_Ch13.- U1_Conv_Ch13.2), Conv_Ch14 (C3_Conv_Ch14.1 C4_Conv_Ch14.- U1_Conv_Ch14.2)
-5 V_CSA: Supply (Csup18.- Csup19.1 Rsup1.1 Usup6.3), IN-OUT (From_CSA_1.26 From_CSA_2.26)
-12in V: Supply (Lref3.1 Lref4.1), IN-OUT (VME-BUS/J1.A31)
GND: Conv_Ch1 (7 pins), Sum-Comp_1 (12 pins), Sum-Comp_2 (12 pins), Sum-Comp_3 (12 pins), Sum-Comp_4 (12 pins), Supply (12 pins), Conv_Ch2 (7 pins), Conv_Ch3 (7 pins), Conv_Ch4 (7 pins), Conv_Ch5 (7 pins), Conv_Ch6 (7 pins), Conv_Ch7 (7 pins), Conv_Ch8 (7 pins), Conv_Ch9 (7 pins), Conv_Ch10 (7 pins), Conv_Ch11 (7 pins), Conv_Ch12 (7 pins), Conv_Ch13 (7 pins), Conv_Ch14 (7 pins), IN-OUT (58 pins)
Sum_1: Sum-Comp_1 (R11_Sum-Comp_1.1), IN-OUT (Sum_out.5)
Sum_2: Sum-Comp_2 (R11_Sum-Comp_2.1), IN-OUT (Sum_out.4)
Sum_3: Sum-Comp_3 (R11_Sum-Comp_3.1), IN-OUT (Sum_out.3)
Sum_4: Sum-Comp_4 (R11_Sum-Comp_4.1), IN-OUT (Sum_out.2)
Sum_ch1: Conv_Ch1 (R5_Conv_Ch1.2), Sum-Comp_1 (R7_Sum-Comp_1.1 U2_Sum-Comp_1.3), Conv_Ch2 (R5_Conv_Ch2.2), Conv_Ch3 (R5_Conv_Ch3.2), Conv_Ch4 (R5_Conv_Ch4.2)
Sum_ch5: Sum-Comp_2 (R7_Sum-Comp_2.1 U2_Sum-Comp_2.3), Conv_Ch5 (R5_Conv_Ch5.2), Conv_Ch6 (R5_Conv_Ch6.2), Conv_Ch7 (R5_Conv_Ch7.2)
Sum_ch10: Sum-Comp_3 (R7_Sum-Comp_3.1 U2_Sum-Comp_3.3), Conv_Ch8 (R5_Conv_Ch8.2), Conv_Ch9 (R5_Conv_Ch9.2), Conv_Ch10 (R5_Conv_Ch10.2)
Sum_ch11: Sum-Comp_4 (R7_Sum-Comp_4.1 U2_Sum-Comp_4.3), Conv_Ch11 (R5_Conv_Ch11.2), Conv_Ch12 (R5_Conv_Ch12.2), Conv_Ch13 (R5_Conv_Ch13.2), Conv_Ch14 (R5_Conv_Ch14.2)
To ADC_ch1: Conv_Ch1 (R4_Conv_Ch1.2), IN-OUT (To_ADC.13)
To ADC_ch2: Conv_Ch2 (R4_Conv_Ch2.2), IN-OUT (To_ADC.25)
To ADC_ch3: Conv_Ch3 (R4_Conv_Ch3.2), IN-OUT (To_ADC.24)
To ADC_ch4: Conv_Ch4 (R4_Conv_Ch4.2), IN-OUT (To_ADC.11)
To ADC_ch5: Conv_Ch5 (R4_Conv_Ch5.2), IN-OUT (To_ADC.10)
To ADC_ch6: Conv_Ch6 (R4_Conv_Ch6.2), IN-OUT (To_ADC.22)
To ADC_ch7: Conv_Ch7 (R4_Conv_Ch7.2), IN-OUT (To_ADC.21)
To ADC_ch8: Conv_Ch8 (R4_Conv_Ch8.2), IN-OUT (To_ADC.18)
To ADC_ch9: Conv_Ch9 (R4_Conv_Ch9.2), IN-OUT (To_ADC.17)
To ADC_ch10: Conv_Ch10 (R4_Conv_Ch10.2), IN-OUT (To_ADC.4)
To ADC_ch11: Conv_Ch11 (R4_Conv_Ch11.2), IN-OUT (To_ADC.3)
To ADC_ch12: Conv_Ch12 (R4_Conv_Ch12.2), IN-OUT (To_ADC.15)
To ADC_ch13: Conv_Ch13 (R4_Conv_Ch13.2), IN-OUT (To_ADC.14)
To ADC_ch14: Conv_Ch14 (R4_Conv_Ch14.2), IN-OUT (To_ADC.1)
Udiff+_ch1: Conv_Ch1 (R1_Conv_Ch1.1 U1_Conv_Ch1.1), IN-OUT (From_CSA_1.25)
Udiff+_ch2: Conv_Ch2 (R1_Conv_Ch2.1 U1_Conv_Ch2.1), IN-OUT (From_CSA_1.24)
Udiff+_ch3: Conv_Ch3 (R1_Conv_Ch3.1 U1_Conv_Ch3.1), IN-OUT (From_CSA_1.23)
Udiff+_ch4: Conv_Ch4 (R1_Conv_Ch4.1 U1_Conv_Ch4.1), IN-OUT (From_CSA_1.22)
Udiff+_ch5: Conv_Ch5 (R1_Conv_Ch5.1 U1_Conv_Ch5.1), IN-OUT (From_CSA_1.21)
Udiff+_ch6: Conv_Ch6 (R1_Conv_Ch6.1 U1_Conv_Ch6.1), IN-OUT (From_CSA_1.20)
Udiff+_ch7: Conv_Ch7 (R1_Conv_Ch7.1 U1_Conv_Ch7.1), IN-OUT (From_CSA_1.19)
Udiff+_ch8: Conv_Ch8 (R1_Conv_Ch8.1 U1_Conv_Ch8.1), IN-OUT (From_CSA_2.25)
Udiff+_ch9: Conv_Ch9 (R1_Conv_Ch9.1 U1_Conv_Ch9.1), IN-OUT (From_CSA_2.24)
Udiff+_ch10: Conv_Ch10 (R1_Conv_Ch10.1 U1_Conv_Ch10.1), IN-OUT (From_CSA_2.23)
Udiff+_ch11: Conv_Ch11 (R1_Conv_Ch11.1 U1_Conv_Ch11.1), IN-OUT (From_CSA_2.22)
Udiff+_ch12: Conv_Ch12 (R1_Conv_Ch12.1 U1_Conv_Ch12.1), IN-OUT (From_CSA_2.21)
Udiff+_ch13: Conv_Ch13 (R1_Conv_Ch13.1 U1_Conv_Ch13.1), IN-OUT (From_CSA_2.20)
Udiff+_ch14: Conv_Ch14 (R1_Conv_Ch14.1 U1_Conv_Ch14.1), IN-OUT (From_CSA_2.19)
Udiff-_ch1: Conv_Ch1 (R6_Conv_Ch1.2 U1_Conv_Ch1.8), IN-OUT (From_CSA_1.7)
Udiff-_ch2: Conv_Ch2 (R6_Conv_Ch2.2 U1_Conv_Ch2.8), IN-OUT (From_CSA_1.6)
Udiff-_ch3: Conv_Ch3 (R6_Conv_Ch3.2 U1_Conv_Ch3.8), IN-OUT (From_CSA_1.5)
Udiff-_ch4: Conv_Ch4 (R6_Conv_Ch4.2 U1_Conv_Ch4.8), IN-OUT (From_CSA_1.4)
Udiff-_ch5: Conv_Ch5 (R6_Conv_Ch5.2 U1_Conv_Ch5.8), IN-OUT (From_CSA_1.3)
Udiff-_ch6: Conv_Ch6 (R6_Conv_Ch6.2 U1_Conv_Ch6.8), IN-OUT (From_CSA_1.2)
Udiff-_ch7: Conv_Ch7 (R6_Conv_Ch7.2 U1_Conv_Ch7.8), IN-OUT (From_CSA_1.1)
Udiff-_ch8: Conv_Ch8 (R6_Conv_Ch8.2 U1_Conv_Ch8.8), IN-OUT (From_CSA_2.7)
Udiff-_ch9: Conv_Ch9 (R6_Conv_Ch9.2 U1_Conv_Ch9.8), IN-OUT (From_CSA_2.6)
Udiff-_ch10: Conv_Ch10 (R6_Conv_Ch10.2 U1_Conv_Ch10.8), IN-OUT (From_CSA_2.5)
Udiff-_ch11: Conv_Ch11 (R6_Conv_Ch11.2 U1_Conv_Ch11.8), IN-OUT (From_CSA_2.4)
Udiff-_ch12: Conv_Ch12 (R6_Conv_Ch12.2 U1_Conv_Ch12.8), IN-OUT (From_CSA_2.3)
Udiff-_ch13: Conv_Ch13 (R6_Conv_Ch13.2 U1_Conv_Ch13.8), IN-OUT (From_CSA_2.2)
Udiff-_ch14: Conv_Ch14 (R6_Conv_Ch14.2 U1_Conv_Ch14.8), IN-OUT (From_CSA_2.1)